# EAGLE schematic MQ (EAGLE 9.6.2)
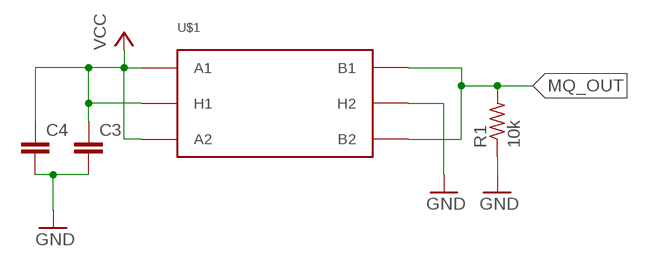
[diagram p0: schematic, sheet 1]

## Parts
C3  C-EUC0603  [C0603]
C4  C-EUC0603  [C0603]
R1  10k  R-US_R0603  [R0603]
U$1  MQ_GAS_SENSOR_SOCKET  [GAS_SENSOR_SOCKET]

## Nets
GND: C3.2 C4.2 R1.1 U$1.H2 U$1.H22(H2)
MQ_OUT: R1.2 U$1.B1 U$1.B2 U$1.B11(B1) U$1.B22(B2)
VCC: C3.1 C4.1 U$1.A1 U$1.A2 U$1.A11(A1) U$1.A22(A2) U$1.H1 U$1.H11(H1)

## Library data of the parts
C3 C4 = rcl:C-EU: CAPACITOR, European symbol; SPICEPREFIX: C
R1 = rcl:R-US_: RESISTOR, American symbol; SPICEPREFIX: R
U$1 = gas_sensor_socket_mq_V2:MQ_GAS_SENSOR_SOCKET